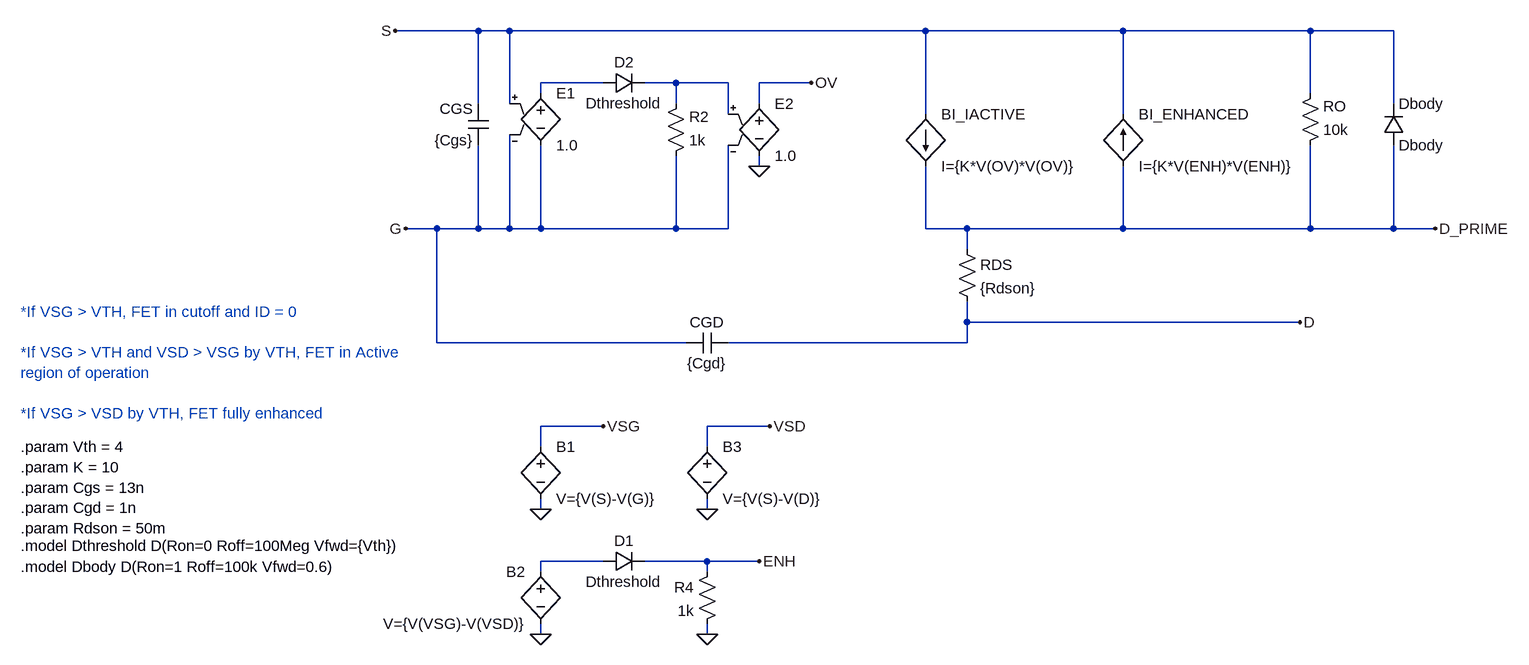
[diagram p0: schematic PWR_PMOS.asc]
PWR_PMOS.asc, the LTspice schematic file:
Version 4.1
SHEET 1 2916 1364
WIRE 288 288 160 288
WIRE 336 288 288 288
WIRE 976 288 336 288
WIRE 1280 288 976 288
WIRE 1568 288 1280 288
WIRE 1696 288 1568 288
WIRE 480 368 384 368
WIRE 592 368 544 368
WIRE 672 368 592 368
WIRE 800 368 720 368
WIRE 384 384 384 368
WIRE 1568 384 1568 288
WIRE 288 400 288 288
WIRE 336 400 336 288
WIRE 592 400 592 368
WIRE 720 400 720 368
WIRE 1696 400 1696 288
WIRE 672 416 672 368
WIRE 976 416 976 288
WIRE 1280 416 1280 288
WIRE 720 496 720 480
WIRE 224 592 176 592
WIRE 288 592 288 464
WIRE 288 592 224 592
WIRE 336 592 336 448
WIRE 336 592 288 592
WIRE 384 592 384 464
WIRE 384 592 336 592
WIRE 592 592 592 480
WIRE 592 592 384 592
WIRE 672 592 672 464
WIRE 672 592 592 592
WIRE 976 592 976 496
WIRE 1040 592 976 592
WIRE 1280 592 1280 496
WIRE 1280 592 1040 592
WIRE 1568 592 1568 464
WIRE 1568 592 1280 592
WIRE 1696 592 1696 464
WIRE 1696 592 1568 592
WIRE 1760 592 1696 592
WIRE 1040 624 1040 592
WIRE 1040 736 1040 704
WIRE 1552 736 1040 736
WIRE 224 768 224 592
WIRE 608 768 224 768
WIRE 1040 768 1040 736
WIRE 1040 768 672 768
WIRE 480 896 384 896
WIRE 736 896 640 896
WIRE 384 928 384 896
WIRE 640 928 640 896
WIRE 384 1024 384 1008
WIRE 640 1024 640 1008
WIRE 480 1104 384 1104
WIRE 640 1104 544 1104
WIRE 720 1104 640 1104
WIRE 384 1120 384 1104
WIRE 640 1120 640 1104
WIRE 384 1216 384 1200
WIRE 640 1216 640 1200
FLAG 1760 592 D_PRIME
FLAG 160 288 S
FLAG 176 592 G
FLAG 800 368 OV
FLAG 720 496 0
FLAG 1552 736 D
FLAG 640 1216 0
FLAG 384 1216 0
FLAG 720 1104 ENH
FLAG 384 1024 0
FLAG 480 896 VSG
FLAG 640 1024 0
FLAG 736 896 VSD
SYMBOL e 384 368 R0
SYMATTR InstName E1
SYMATTR Value 1.0
SYMBOL res 576 496 M180
WINDOW 0 36 76 Left 2
WINDOW 3 36 40 Left 2
SYMATTR InstName R2
SYMATTR Value 1k
SYMBOL diode 480 352 M90
WINDOW 0 0 32 VBottom 2
WINDOW 3 32 32 VTop 2
SYMATTR InstName D2
SYMATTR Value Dthreshold
SYMBOL cap 304 464 R180
WINDOW 0 24 56 Left 2
WINDOW 3 24 8 Left 2
SYMATTR InstName CGS
SYMATTR Value {Cgs}
SYMBOL cap 608 784 R270
WINDOW 0 32 32 VTop 2
WINDOW 3 0 32 VBottom 2
SYMATTR InstName CGD
SYMATTR Value {Cgd}
SYMBOL res 1552 480 M180
WINDOW 0 36 76 Left 2
WINDOW 3 36 40 Left 2
SYMATTR InstName RO
SYMATTR Value 10k
SYMBOL e 720 384 R0
SYMATTR InstName E2
SYMATTR Value 1.0
SYMBOL bi 976 416 R0
SYMATTR InstName BI_IACTIVE
SYMATTR Value I={K*V(OV)*V(OV)}
SYMBOL bv 384 1104 M0
SYMATTR InstName B2
SYMATTR Value V={V(VSG)-V(VSD)}
SYMBOL res 1024 608 R0
SYMATTR InstName RDS
SYMATTR Value {Rdson}
SYMBOL diode 480 1120 R270
WINDOW 0 32 32 VTop 2
WINDOW 3 0 32 VBottom 2
SYMATTR InstName D1
SYMATTR Value Dthreshold
SYMBOL res 656 1104 M0
SYMATTR InstName R4
SYMATTR Value 1k
SYMBOL bi 1280 496 M180
WINDOW 0 24 80 Left 2
WINDOW 3 24 0 Left 2
SYMATTR InstName BI_ENHANCED
SYMATTR Value I={K*V(ENH)*V(ENH)}
SYMBOL bv 384 912 R0
SYMATTR InstName B1
SYMATTR Value V={V(S)-V(G)}
SYMBOL bv 640 912 R0
SYMATTR InstName B3
SYMATTR Value V={V(S)-V(D)}
SYMBOL diode 1680 464 M180
WINDOW 0 24 64 Left 2
WINDOW 3 24 0 Left 2
SYMATTR InstName Dbody
SYMATTR Value Dbody
TEXT -416 928 Left 2 !.param Vth = 4\n.param K = 10\n.param Cgs = 13n\n.param Cgd = 1n\n.param Rdson = 50m
TEXT -416 1080 Left 2 !.model Dthreshold D(Ron=0 Roff=100Meg Vfwd={Vth})
TEXT -416 720 Left 2 ;*If VSG > VTH, FET in cutoff and ID = 0\n \n*If VSG > VTH and VSD > VSG by VTH, FET in Active\nregion of operation\n \n*If VSG > VSD by VTH, FET fully enhanced
TEXT -416 1112 Left 2 !.model Dbody D(Ron=1 Roff=100k Vfwd=0.6)

The netlist it stands for:
* PWR_PMOS.asc
E1 N001 G S G 1.0
R2 G N002 1k
D2 N001 N002 Dthreshold
CGS G S {Cgs}
CGD G D {Cgd}
RO D_PRIME S 10k
E2 OV 0 N002 G 1.0
BI_IACTIVE S D_PRIME I={K*V(OV)*V(OV)}
B2 N003 0 V={V(VSG)-V(VSD)}
RDS D_PRIME D {Rdson}
D1 N003 ENH Dthreshold
R4 ENH 0 1k
BI_ENHANCED D_PRIME S I={K*V(ENH)*V(ENH)}
B1 VSG 0 V={V(S)-V(G)}
B3 VSD 0 V={V(S)-V(D)}
Dbody D_PRIME S Dbody
.model D D
.lib standard.dio
.param Vth = 4
.param K = 10
.param Cgs = 13n
.param Cgd = 1n
.param Rdson = 50m
.model Dthreshold D(Ron=0 Roff=100Meg Vfwd={Vth})
* *If VSG > VTH, FET in cutoff and ID = 0
* *If VSG > VTH and VSD > VSG by VTH, FET in Active
* region of operation
* *If VSG > VSD by VTH, FET fully enhanced
.model Dbody D(Ron=1 Roff=100k Vfwd=0.6)
.backanno
.end